# Altium schematic sheet PCMCIA Type 2 Un-Shielded 9 Pin IO Connector.schdoc: PCMCIA Type 2 Un-Shielded 9 Pin IO Connector
size A; Organization: Organization; Address1: Address1; Address2: Address2; Address3: Address3; Address4: Address4; DocumentNumber: 1; Revision: 0; SheetNumber: 2; SheetTotal: 2
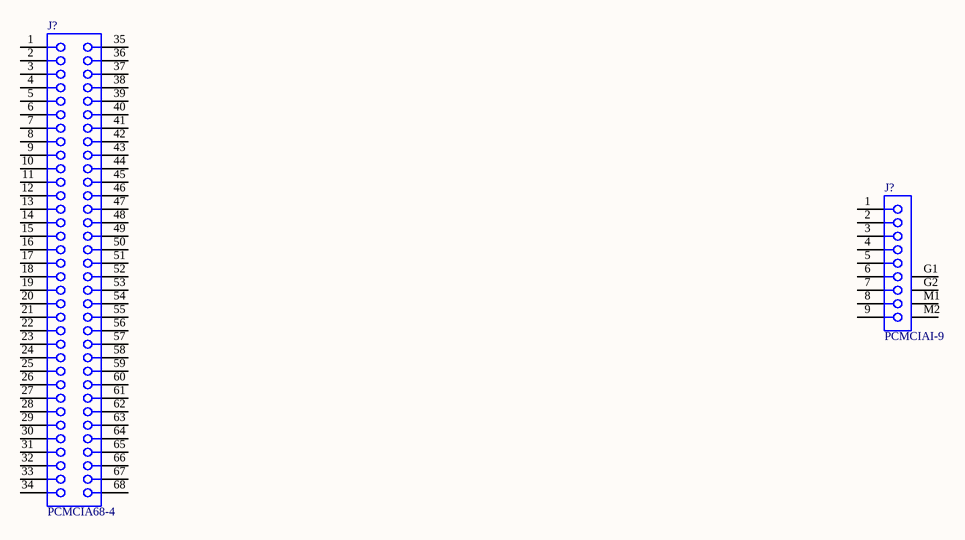
[diagram p0: PCMCIA Type 2 Un-Shielded 9 Pin IO Connector.schdoc]

## Parts
(Parts that share a designator on the sheet are numbered #1, #2 ... from top to bottom, then left to right.)
J?#1  PCMCIA68-4  [PCMCIA68-4]
J?#2  PCMCIAI-9  [PCMCIAI-9]

## Nets

Not connected (* = marked no-connect by the designer): J?#1 1 2 3 4 5 6 7 8 9 10 11 12 13 14 15 16 17 18 19 20 21 22 23 24 25 26 27 28 29 30 31 32 33 34 35 36 37 38 39 40 41 42 43 44 45 46 47 48 49 50 51 52 53 54 55 56 57 58 59 60 61 62 63 64 65 66 67 68; J?#2 1 2 3 4 5 6 7 8 9 G1 G2 M1 M2

## Library data of the parts
J?#1 = PCMCIA68-4: Receptacle Assembly, PC Card, 68-Position, 0.41mm [016in] PCB Offset, Surface Mount; Text Field6: Alternate Layout Available; Text Field7: Published 14-Feb-2002
J?#2 = PCMCIAI-9: Receptacle Assembly, PC Card, 9-Position; Text Field7: Published 14-Feb-2002